# Altium schematic sheet NTC.SchDoc: NTC
size 420 x 297 mm; SheetNumber: 9; SheetTotal: 12
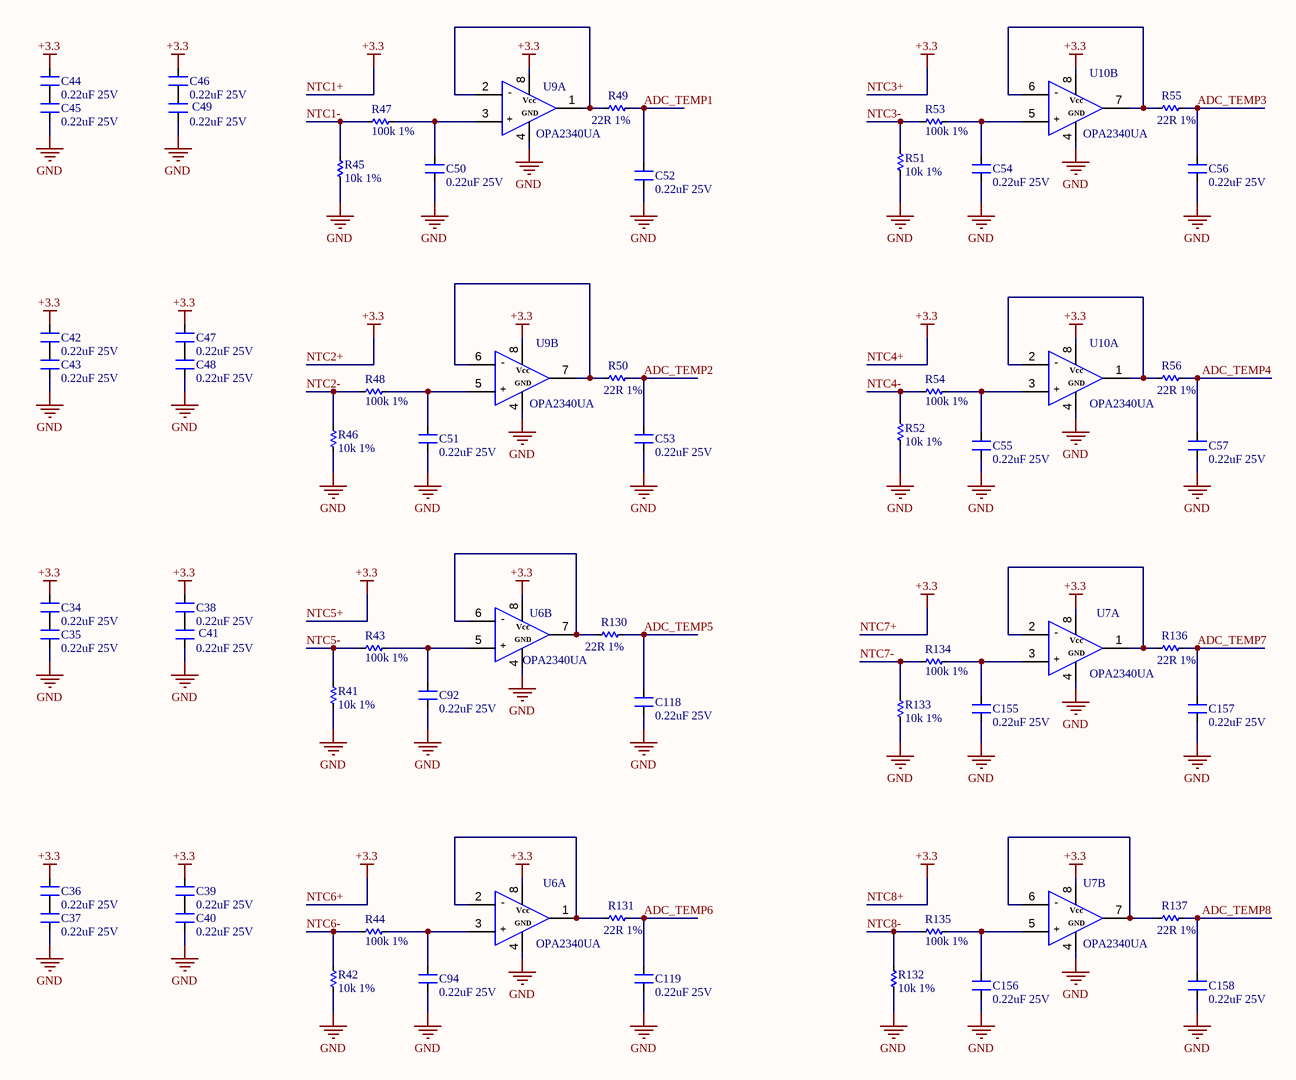
[diagram p0: NTC.SchDoc]

## Parts
C34  0.22uF 25V  [CN-SMD-0603-EXP-V101]
C35  0.22uF 25V  [CN-SMD-0603-EXP-V101]
C36  0.22uF 25V  [CN-SMD-0603-EXP-V101]
C37  0.22uF 25V  [CN-SMD-0603-EXP-V101]
C38  0.22uF 25V  [CN-SMD-0603-EXP-V101]
C39  0.22uF 25V  [CN-SMD-0603-EXP-V101]
C40  0.22uF 25V  [CN-SMD-0603-EXP-V101]
C41  0.22uF 25V  [CN-SMD-0603-EXP-V101]
C42  0.22uF 25V  [CN-SMD-0603-EXP-V101]
C43  0.22uF 25V  [CN-SMD-0603-EXP-V101]
C44  0.22uF 25V  [CN-SMD-0603-EXP-V101]
C45  0.22uF 25V  [CN-SMD-0603-EXP-V101]
C46  0.22uF 25V  [CN-SMD-0603-EXP-V101]
C47  0.22uF 25V  [CN-SMD-0603-EXP-V101]
C48  0.22uF 25V  [CN-SMD-0603-EXP-V101]
C49  0.22uF 25V  [CN-SMD-0603-EXP-V101]
C50  0.22uF 25V  [CN-SMD-0603-EXP-V101]
C51  0.22uF 25V  [CN-SMD-0603-EXP-V101]
C52  0.22uF 25V  [CN-SMD-0603-EXP-V101]
C53  0.22uF 25V  [CN-SMD-0603-EXP-V101]
C54  0.22uF 25V  [CN-SMD-0603-EXP-V101]
C55  0.22uF 25V  [CN-SMD-0603-EXP-V101]
C56  0.22uF 25V  [CN-SMD-0603-EXP-V101]
C57  0.22uF 25V  [CN-SMD-0603-EXP-V101]
C92  0.22uF 25V  [CN-SMD-0603-EXP-V101]
C94  0.22uF 25V  [CN-SMD-0603-EXP-V101]
C118  0.22uF 25V  [CN-SMD-0603-EXP-V101]
C119  0.22uF 25V  [CN-SMD-0603-EXP-V101]
C155  0.22uF 25V  [CN-SMD-0603-EXP-V101]
C156  0.22uF 25V  [CN-SMD-0603-EXP-V101]
C157  0.22uF 25V  [CN-SMD-0603-EXP-V101]
C158  0.22uF 25V  [CN-SMD-0603-EXP-V101]
R41  10k 1%  [RES-SMD-0603-EXP-V101]
R42  10k 1%  [RES-SMD-0603-EXP-V101]
R43  100k 1%  [RES-SMD-0603-EXP-V101]
R44  100k 1%  [RES-SMD-0603-EXP-V101]
R45  10k 1%  [RES-SMD-0603-EXP-V101]
R46  10k 1%  [RES-SMD-0603-EXP-V101]
R47  100k 1%  [RES-SMD-0603-EXP-V101]
R48  100k 1%  [RES-SMD-0603-EXP-V101]
R49  22R 1%  [RES-SMD-0603-EXP-V101]
R50  22R 1%  [RES-SMD-0603-EXP-V101]
R51  10k 1%  [RES-SMD-0603-EXP-V101]
R52  10k 1%  [RES-SMD-0603-EXP-V101]
R53  100k 1%  [RES-SMD-0603-EXP-V101]
R54  100k 1%  [RES-SMD-0603-EXP-V101]
R55  22R 1%  [RES-SMD-0603-EXP-V101]
R56  22R 1%  [RES-SMD-0603-EXP-V101]
R130  22R 1%  [RES-SMD-0603-EXP-V101]
R131  22R 1%  [RES-SMD-0603-EXP-V101]
R132  10k 1%  [RES-SMD-0603-EXP-V101]
R133  10k 1%  [RES-SMD-0603-EXP-V101]
R134  100k 1%  [RES-SMD-0603-EXP-V101]
R135  100k 1%  [RES-SMD-0603-EXP-V101]
R136  22R 1%  [RES-SMD-0603-EXP-V101]
R137  22R 1%  [RES-SMD-0603-EXP-V101]
U6  OPA2340UA  [SO8]  (parts A,B of 2)
U7  OPA2340UA  [SO8]  (parts A,B of 2)
U9  OPA2340UA  [SO8]  (parts A,B of 2)
U10  OPA2340UA  [SO8]  (parts A,B of 2)

## Nets
GND: C35.1 C37.1 C40.1 C41.1 C43.1 C45.1 C48.1 C49.1 C50.1 C51.1 C52.1 C53.1 C54.1 C55.1 C56.1 C57.1 C92.1 C94.1 C118.1 C119.1 C155.1 C156.1 C157.1 C158.1 R41.2 R42.2 R45.2 R46.2 R51.2 R52.2 R132.2 R133.2 U6.4 U7.4 U9.4 U10.4
NTC1+: C34.2 C36.2 C38.2 C39.2 C42.2 C44.2 C46.2 C47.2 U6.8 U7.8 U9.8 U10.8  [also labelled +3.3, NTC2+, NTC3+, NTC4+, NTC5+, NTC6+, NTC7+, NTC8+]
ADC_TEMP1: C52.2 R49.2
ADC_TEMP2: C53.2 R50.2
ADC_TEMP3: C56.2 R55.2
ADC_TEMP4: C57.2 R56.2
ADC_TEMP5: C118.2 R130.2
ADC_TEMP6: C119.2 R131.2
ADC_TEMP7: C157.2 R136.2
ADC_TEMP8: C158.2 R137.2
NTC1-: R45.1 R47.1
NTC2-: R46.1 R48.1
NTC3-: R51.1 R53.1
NTC4-: R52.1 R54.1
NTC5-: R41.1 R43.1
NTC6-: R42.1 R44.1
NTC7-: R133.1 R134.1
NTC8-: R132.1 R135.1
NetC34_1: C34.1 C35.2
NetC36_1: C36.1 C37.2
NetC38_1: C38.1 C41.2
NetC39_1: C39.1 C40.2
NetC42_1: C42.1 C43.2
NetC44_1: C44.1 C45.2
NetC46_1: C46.1 C49.2
NetC47_1: C47.1 C48.2
NetC50_2: C50.2 R47.2 U9.3
NetC51_2: C51.2 R48.2 U9.5
NetC54_2: C54.2 R53.2 U10.5
NetC55_2: C55.2 R54.2 U10.3
NetC92_2: C92.2 R43.2 U6.5
NetC94_2: C94.2 R44.2 U6.3
NetC155_2: C155.2 R134.2 U7.3
NetC156_2: C156.2 R135.2 U7.5
NetR49_1: R49.1 U9.1 U9.2
NetR50_1: R50.1 U9.6 U9.7
NetR55_1: R55.1 U10.6 U10.7
NetR56_1: R56.1 U10.1 U10.2
NetR130_1: R130.1 U6.6 U6.7
NetR131_1: R131.1 U6.1 U6.2
NetR136_1: R136.1 U7.1 U7.2
NetR137_1: R137.1 U7.6 U7.7

## Notes on the sheet
- Project:
- PEE-PC1
- Sub-system:
- NANORACK_EXP_CONTROLLER
- Design by:
- SANG HUYNH
- BAO BUI Q.
- Sheet title:
- Sheet
- A3
- of
- Checked by:
- Approved by:
- VU PHAM
- Revision:
- Document No:
- V1.0.0
- Size:
- Date:
- (in symbol OPA2340UA/2K5, part A) -; Vcc; GND; +
- (in symbol OPA2340UA/2K5, part B) -; Vcc; GND; +

## Library data of the parts
C34-C57 C92 C94 C118 C119 C155-C158 = Capacitors: Value: 33pF
R41-R56 R130-R137 = Res SMD: SMD; Manufacturer: Generic Components; Class: Passive; Published: 08/06/2000; Publisher: Altium Hobart Technology Centre
U6 U7 U9 U10 = OPA2340UA/2K5